# EAGLE design Motor_Driver (EAGLE 9.3.0)
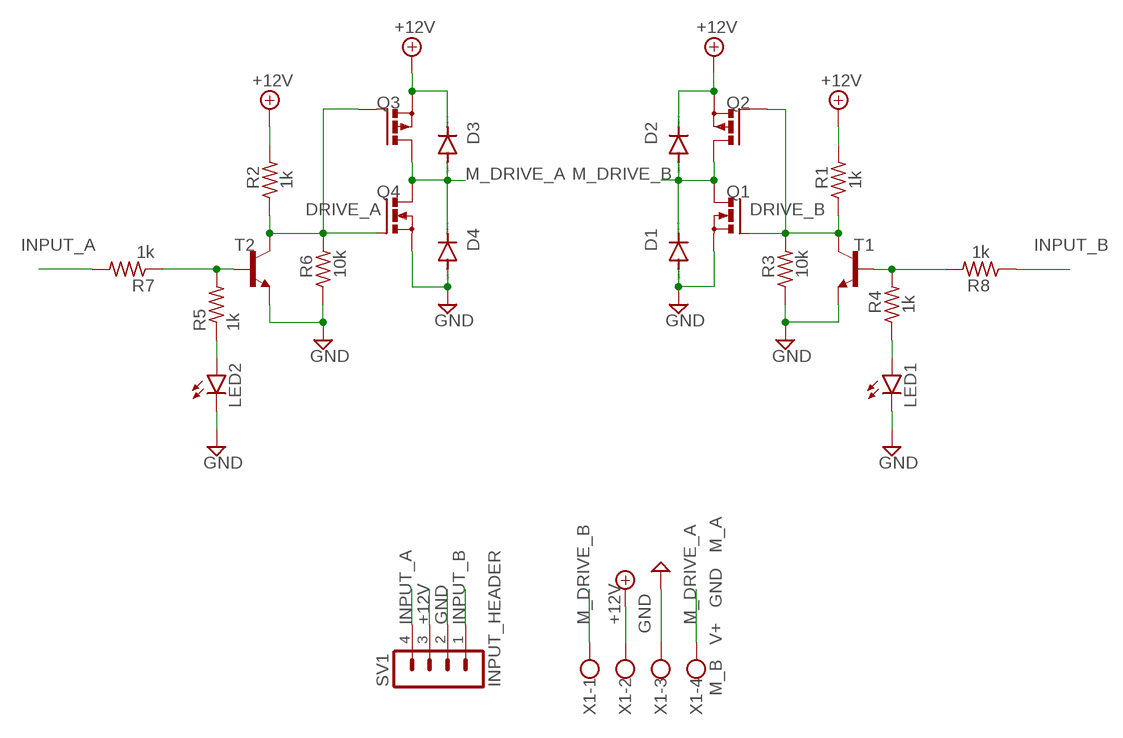
[diagram p0: schematic, sheet 1]

## Parts
D1  1N4148DO35-10  [DO35-10]
D2  1N4148DO35-10  [DO35-10]
D3  1N4148DO35-10  [DO35-10]
D4  1N4148DO35-10  [DO35-10]
LED1  LED_B  LED5MM  [LED5MM]
LED2  LED_A  LED5MM  [LED5MM]
Q1  N_B  PMOSFET_NTO220BV  [TO220BV]
Q2  P_B  PMOSFET_PTO220BV  [TO220BV]
Q3  P_A  PMOSFET_PTO220BV  [TO220BV]
Q4  N_A  PMOSFET_NTO220BV  [TO220BV]
R1  1k  R-US_0207/10  [0207/10]
R2  1k  R-US_0207/10  [0207/10]
R3  10k  R-US_0207/10  [0207/10]
R4  1k  R-US_0207/10  [0207/10]
R5  1k  R-US_0207/10  [0207/10]
R6  10k  R-US_0207/10  [0207/10]
R7  1k  R-US_0207/10  [0207/10]
R8  1k  R-US_0207/10  [0207/10]
SV1  INPUT_HEADER  MA04-1  [MA04-1]
T1  2N3904  [TO92]
T2  2N3904  [TO92]
X1  M_B V+ GND M_A  W237-4  [W237-4]

## Nets
+12V: D2.C D3.C Q2.S Q3.S R1.2 R2.2 SV1.3 X1.2
DRIVE_A: Q3.G Q4.G R2.1 R6.2 T2.1(C)
DRIVE_B: Q1.G Q2.G R1.1 R3.2 T1.1(C)
GND: D1.A D4.A LED1.K(C) LED2.K(C) Q1.S Q4.S R3.1 R6.1 SV1.2 T1.3(E) T2.3(E) X1.3
INPUT_A: R7.2 SV1.4
INPUT_B: R8.1 SV1.1
M_DRIVE_A [Motor_Power]: D3.A D4.C Q3.D Q4.D X1.4
M_DRIVE_B [Motor_Power]: D1.C D2.A Q1.D Q2.D X1.1
N$1: R5.2 R7.1 T2.2(B)
N$2: LED2.A R5.1
N$3: R4.2 R8.2 T1.2(B)
N$4: LED1.A R4.1

## Library data of the parts
D1-D4 = diode:1N4148: DIODE high speed (Philips)
LED1 LED2 = led:LED: LED OSRAM: - CHIPLED LG R971, LG N971, LY N971, LG Q971, LY Q971, LO R971, LY R971 LH N974, LH R974 LS Q976, LO Q976, LY Q976 LO Q996 - Hyper CHIPLED LW Q18S LB Q993, LB Q99A, LB R99A - SideLED LS A670, LO A670, LY A670, LG A670, LP A670 LB A673, LV A673, LT A673, LW A673 LH A674 LY A675 LS A676, LA A676, LO A676, LY A676, LW A676 LS A679, LY A679, LG A679 - Hyper Micro SIDELED® LS Y876, LA Y876, LO Y876, LY Y876 LT Y87S - SmartLED LW L88C, LW L88S LB L89C, LB L89S, LG L890 LS L89K, LO L89K, LY L89K LS L896, LA L896, LO L896, LY L896 - TOPLED LS T670, LO T670, LY T670, LG T670, LP T670 LSG T670, LSP T670, LSY T670, LOP T670, LYG T670 LG T671, LOG T671, LSG T671 LB T673, LV T673, LT T673, LW T673 LH T674 LS T676, LA T676, LO T676, LY T676, LB T676, LH T676, LSB T676, LW T676 LB T67C, LV T67C, LT T67C, LS T67K, LO T67K, LY T67K, LW E67C LS E67B, LA E67B, LO E67B, LY E67B, LB E67C, LV E67C, LT E67C LW T67C LS T679, LY T679, LG T679 LS T770, LO T770, LY T770, LG T770, LP T770 LB T773, LV T773, LT T773, LW T773 LH T774 LS E675, LA E675, LY E675, LS T675 LS T776, LA T776, LO T776, LY T776, LB T776 LHGB T686 LT T68C, LB T68C - Hyper Mini TOPLED® LB M676 - Mini TOPLED Santana® LG M470 LS M47K, LO M47K, LY M47K Source: http://www.osram.convergy.de LUXEON: - LUMILED® LXK2-PW12-R00, LXK2-PW12-S00, LXK2-PW14-U00, LXK2-PW14-V00 LXK2-PM12-R00, LXK2-PM12-S00, LXK2-PM14-U00 LXK2-PE12-Q00, LXK2-PE12-R00, LXK2-PE12-S00, LXK2-PE14-T00, LXK2-PE14-U00 LXK2-PB12-K00, LXK2-PB12-L00, LXK2-PB12-M00, LXK2-PB14-N00, LXK2-PB14-P00, LXK2-PB14-Q00 LXK2-PR12-L00, LXK2-PR12-M00, LXK2-PR14-Q00, LXK2-PR14-R00 LXK2-PD12-Q00, LXK2-PD12-R00, LXK2-PD12-S00 LXK2-PH12-R00, LXK2-PH12-S00 LXK2-PL12-P00, LXK2-PL12-Q00, LXK2-PL12-R00 Source: www.luxeon.com KINGBRIGHT: KA-3528ASYC Source: www.kingbright.com
Q1 Q4 = transistor-power:PMOSFET_N: Power MOSFET N-Channel
Q2 Q3 = transistor-power:PMOSFET_P: Power MOSFET P-Channel
R1-R8 = resistor:R-US_: RESISTOR, American symbol
SV1 = MyParts:MA04-1: PIN HEADER; OC_FARNELL: unknown; OC_NEWARK: unknown
T1 T2 = transistor:2N3904: NPN TRANSISTOR
X1 = MyParts:W237-4: WAGO SCREW CLAMP; OC_FARNELL: unknown; OC_NEWARK: unknown

## Net classes
1 Motor_Power: width 1.27 mm

## Board
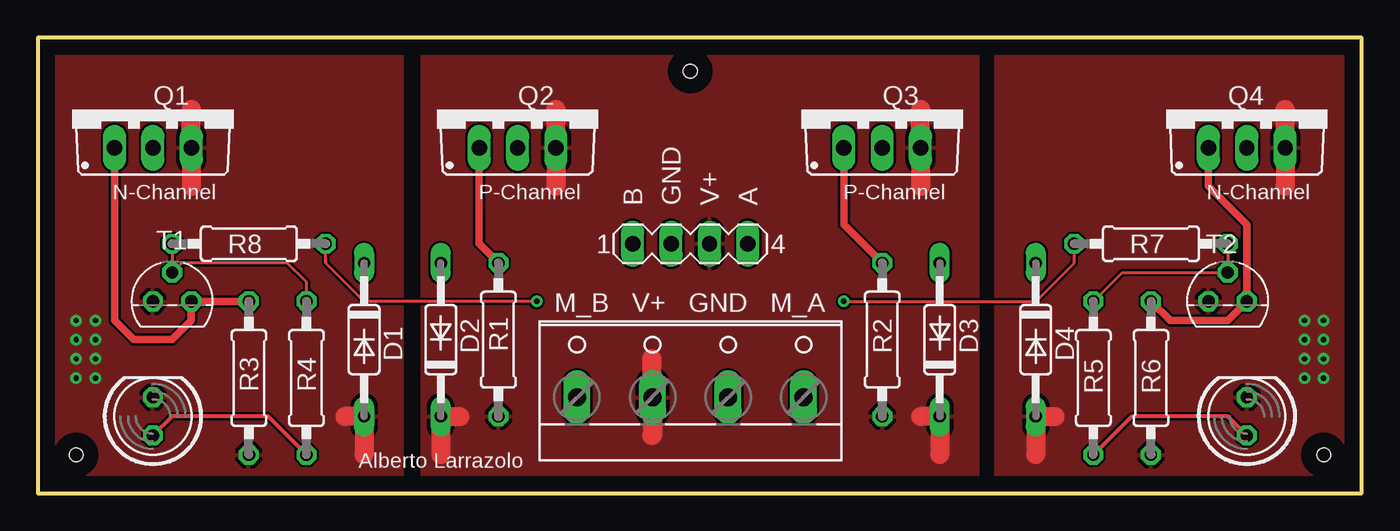
[diagram p1: board, top side]
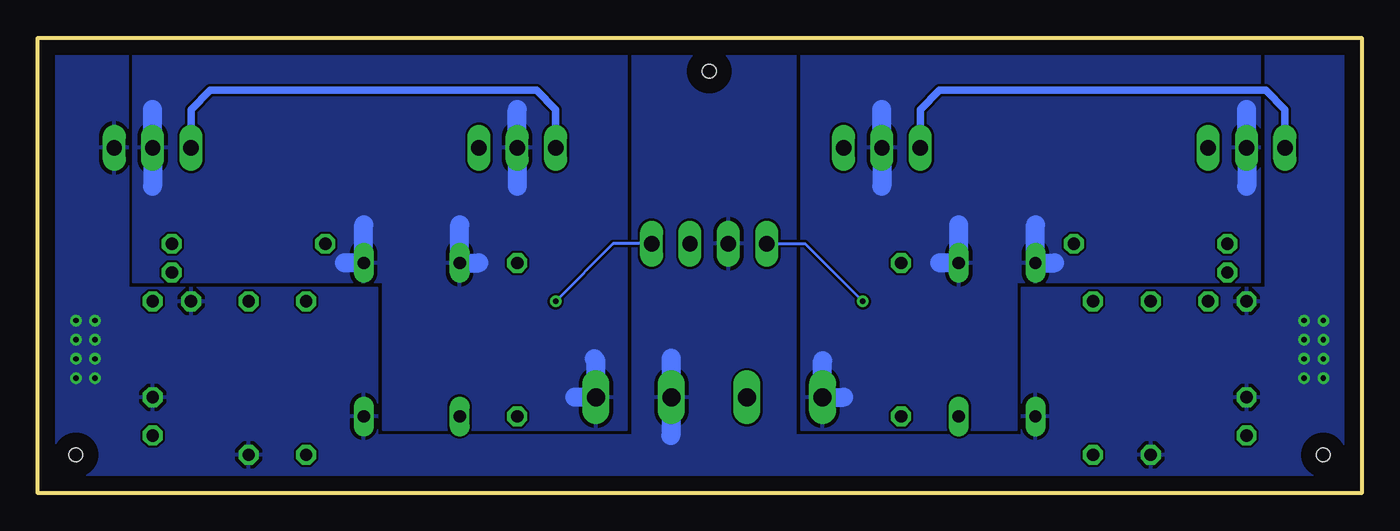
[diagram p2: board, bottom side, seen from below]

Size 87.61 x 30.15 mm. Coordinates in mm from the lower left corner, seen from the top.
Outline: 0,0 87.61,0 87.61,30.15 0,30.15 0,0
Copper layers (1*16): Top 0.035mm / dielectric 1.5mm / Bottom 0.035mm
Design rules "default": minimum track width 6mil, minimum drill 0.35mm, track to track 6mil, track to pad 6mil, pad to pad 6mil, via to via 6mil, smd to smd 6mil, copper to edge 40mil, drill to drill 6mil, minimum pad ring 10mil, minimum via ring 8mil, stop-mask expansion 4mil, vias tented up to drill 0mil, thermal gap 10mil
Holes 0.9 mm at 43.18,27.94 2.54,2.54 85.09,2.54

### Footprints (pad centres in the part's own frame; a part is rotated, then mirrored left to right if it is on the bottom)
DO35-10 = drill 0.813 long: A 5.08,0; C -5.08,0
LED5MM = drill 0.813 octagon: A -1.27,0; K 1.27,0
TO220BV = drill 1.016 long: D 0,-2.54; G -2.54,-2.54; S 2.54,-2.54
0207/10 = drill 0.813 octagon: 1 -5.08,0; 2 5.08,0
MA04-1 = drill 1.016 long: 1 -3.81,0; 2 -1.27,0; 3 1.27,0; 4 3.81,0
TO92 = drill 0.813 octagon: 1 1.27,0; 2 0,1.905; 3 -1.27,0
W237-4 = drill 1.194 long: 1 -7.5,-1.27; 2 -2.5,-1.27; 3 2.5,-1.27; 4 7.5,-1.27

### Placement (x,y rotation side)
D1  21.59,10.16 270 top
D2  26.67,10.16 90 top
D3  59.69,10.16 90 top
D4  66.04,10.16 270 top
LED1  7.62,5.08 90 top
LED2  80.01,5.08 90 top
Q1  7.62,25.4 0 top
Q2  31.75,25.4 0 top
Q3  55.88,25.4 0 top
Q4  80.01,25.4 0 top
R1  30.48,10.16 270 top
R2  55.88,10.16 270 top
R3  13.97,7.62 90 top
R4  17.78,7.62 90 top
R5  69.85,7.62 90 top
R6  73.66,7.62 90 top
R7  73.66,16.51 180 top
R8  13.97,16.51 180 top
SV1  43.18,16.51 0 top
T1  8.89,12.7 0 top
T2  78.74,12.7 0 top
X1  43.18,7.62 0 top

### Tracks (layer width: path | path; a pad name or v marks a point on that pad's centre or on a via)
+12V
  Top 1.27: 34.29,20.32 Q2.S 34.29,25.4 | 58.42,20.32 Q3.S 58.42,25.4 | 40.64,8.89 40.64,6.39 X1.2 40.68,3.85 40.64,3.81 | 26.67,2.54 D2.C 27.94,5.08 | 58.42,5.08 D3.C 59.69,2.54
  pour Top: 25.4,30.48 25.4,-1.27 62.23,-1.27 62.23,30.48
DRIVE_A
  Top 0.508: R2.1 53.34,17.78 Q3.G | Q4.G 77.47,20.32 80.01,17.78 T2.1 78.74,11.43 74.93,11.43 R6.2
  Bottom 0.508: Q3.G 53.34,25.4 54.61,26.67 76.2,26.67 77.47,25.4 Q4.G
DRIVE_B
  Top 0.508: Q2.G 29.21,16.51 R1.1 | Q1.G 5.08,11.43 6.35,10.16 8.89,10.16 10.16,11.43 T1.1 R3.2
  Bottom 0.508: Q1.G 5.08,25.4 6.35,26.67 27.94,26.67 29.21,25.4 Q2.G
GND  (via drill 0.35)
  Top 1.27: 82.55,20.32 Q4.S 82.55,25.4 | 10.16,20.32 Q1.S 10.16,25.4 | 21.59,2.54 D1.A 20.32,5.08 | 66.04,2.54 D4.A 67.31,5.08
  Bottom 1.27: 45.68,8.93 X1.3 45.72,6.31 45.72,3.81
  other vias: 3.81,8.89 2.54,8.89 2.54,10.16 3.81,10.16 3.81,7.62 3.81,11.43 2.54,11.43 2.54,7.62 85.09,7.62 85.09,8.89 85.09,10.16 85.09,11.43 83.82,7.62 83.82,8.89 83.82,10.16 83.82,11.43
  pour Bottom: -2.54,31.75 -2.54,-2.54 90.17,-2.54 90.17,31.75 81.66,31.75 81.64,13.59 65.15,13.59 65.15,3.81 48.26,3.81 48.26,31.75 37.47,31.75 37.47,3.81 22.48,3.81 22.48,13.59 6.35,13.59 6.35,31.75
  pour Top: 63.37,30.48 63.37,-1.27 91.44,-1.27 91.44,30.48
  pour Top: -1.27,30.48 -1.27,-1.27 24.13,-1.27 24.13,30.48
INPUT_A  (via drill 0.35)
  Top 0.203: v53.34,12.7 66.04,12.7 68.58,15.24 R7.2
  Bottom 0.203: SV1.4 49.53,16.51 v53.34,12.7
INPUT_B  (via drill 0.35)
  Top 0.203: v33.02,12.7 21.59,12.7 19.05,15.24 R8.1
  Bottom 0.203: SV1.1 36.83,16.51 v33.02,12.7
M_DRIVE_A
  Bottom 1.27: 55.88,20.32 Q3.D 55.88,25.4 | 80.01,25.4 Q4.D 80.01,20.32 | 50.8,8.89 50.68,8.77 X1.4 52.07,6.35 | 67.31,15.24 D4.C 66.04,17.78 | 58.42,15.24 D3.A 59.69,17.78
  pour Bottom: 81.28,31.75 81.28,13.97 64.77,13.97 64.77,4.19 48.64,4.19 48.64,31.75
M_DRIVE_B
  Bottom 1.27: 7.62,20.32 Q1.D 7.62,25.4 | 31.75,20.32 Q2.D 31.75,25.4 | 35.68,8.77 X1.1 34.29,6.35 | 21.59,17.78 D1.C 20.32,15.24 | 27.94,15.24 D2.A 26.67,17.78
  pour Bottom: 37.08,31.75 37.08,4.19 22.86,4.19 22.86,13.97 6.73,13.97 6.73,31.75
N$1
  Top 0.203: R5.2 71.75,14.61 T2.2 R7.1
N$2
  Top 0.254: LED2.A 78.74,5.08 72.39,5.08 R5.1
N$3
  Top 0.203: R4.2 17.78,13.97 16.51,15.24 9.53,15.24 T1.2 R8.2
N$4
  Top 0.254: R4.1 15.24,5.08 8.89,5.08 LED1.A

### Text on the board
tPlace: N-Channel | P-Channel | P-Channel | N-Channel | Alberto Larrazolo